# Altium project motor driver_Project.PrjPcb
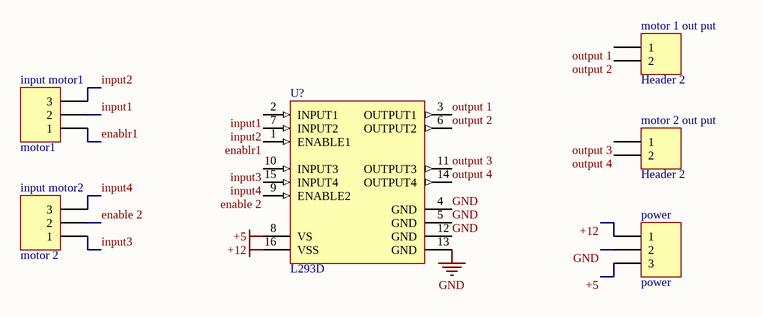
[diagram p0: Sheet3.SchDoc]
1 sheet, 6 parts. Net scope: global (net labels, ports and power ports of the same name join across sheets).
Board file: PCB2.PcbDoc

## Sheet Sheet3.SchDoc
size A; SheetNumber: 1; SheetTotal: 1

### Parts
input_motor1  motor1  [HDR1X3]
input_motor2  motor 2  [HDR1X3]
L293D  L293D  [STM-L293D-16]
motor_1_out_put  Header 2  [HDR1X2]
motor_2_out_put  Header 2  [HDR1X2]
power  power  [HDR1X3]

### Nets
+5: L293D.8(VS) power.3
+12: L293D.16(VSS) power.1
GND: L293D.4(GND) L293D.5(GND) L293D.12(GND) L293D.13(GND) power.2
enable 2: input_motor2.2 L293D.9(ENABLE2)
enablr1: input_motor1.1 L293D.1(ENABLE1)
input1: input_motor1.2 L293D.2(INPUT1)
input2: input_motor1.3 L293D.7(INPUT2)
input3: input_motor2.1 L293D.10(INPUT3)
input4: input_motor2.3 L293D.15(INPUT4)
output 1: L293D.3(OUTPUT1) motor_1_out_put.1
output 2: L293D.6(OUTPUT2) motor_1_out_put.2
output 3: L293D.11(OUTPUT3) motor_2_out_put.1
output 4: L293D.14(OUTPUT4) motor_2_out_put.2

### Library data of the parts
input_motor1 input_motor2 power = Header 3: Header, 3-Pin; LatestRevisionDate: 17-Jul-2002; LatestRevisionNote: Re-released for DXP Platform.; Publisher: Altium Limited
L293D = CMP-2000-06524-1: Push-Pull Four Channel Driver with Diode, 4.5 to 36 V, -40 to 150 degC, 16-Pin PDIP, RoHS, Tube; Manufacturer: STMicroelectronics; Number of Outputs: 4; Current - Peak Output: 1.2A; Current - Output / Channel: 600mA; Input Type: Non-Inverting; Other Related Documents: L293DViewAllSpecifications; Dynamic Catalog: HalfBridge; Voltage - Supply: 4.5V~36V; Other Names: 497-2936-5
motor_1_out_put motor_2_out_put = Header 2: Header, 2-Pin; LatestRevisionDate: 17-Jul-2002; LatestRevisionNote: Re-released for DXP Platform.; Publisher: Altium Limited